# EAGLE schematic untitled (EAGLE 9.6.2)
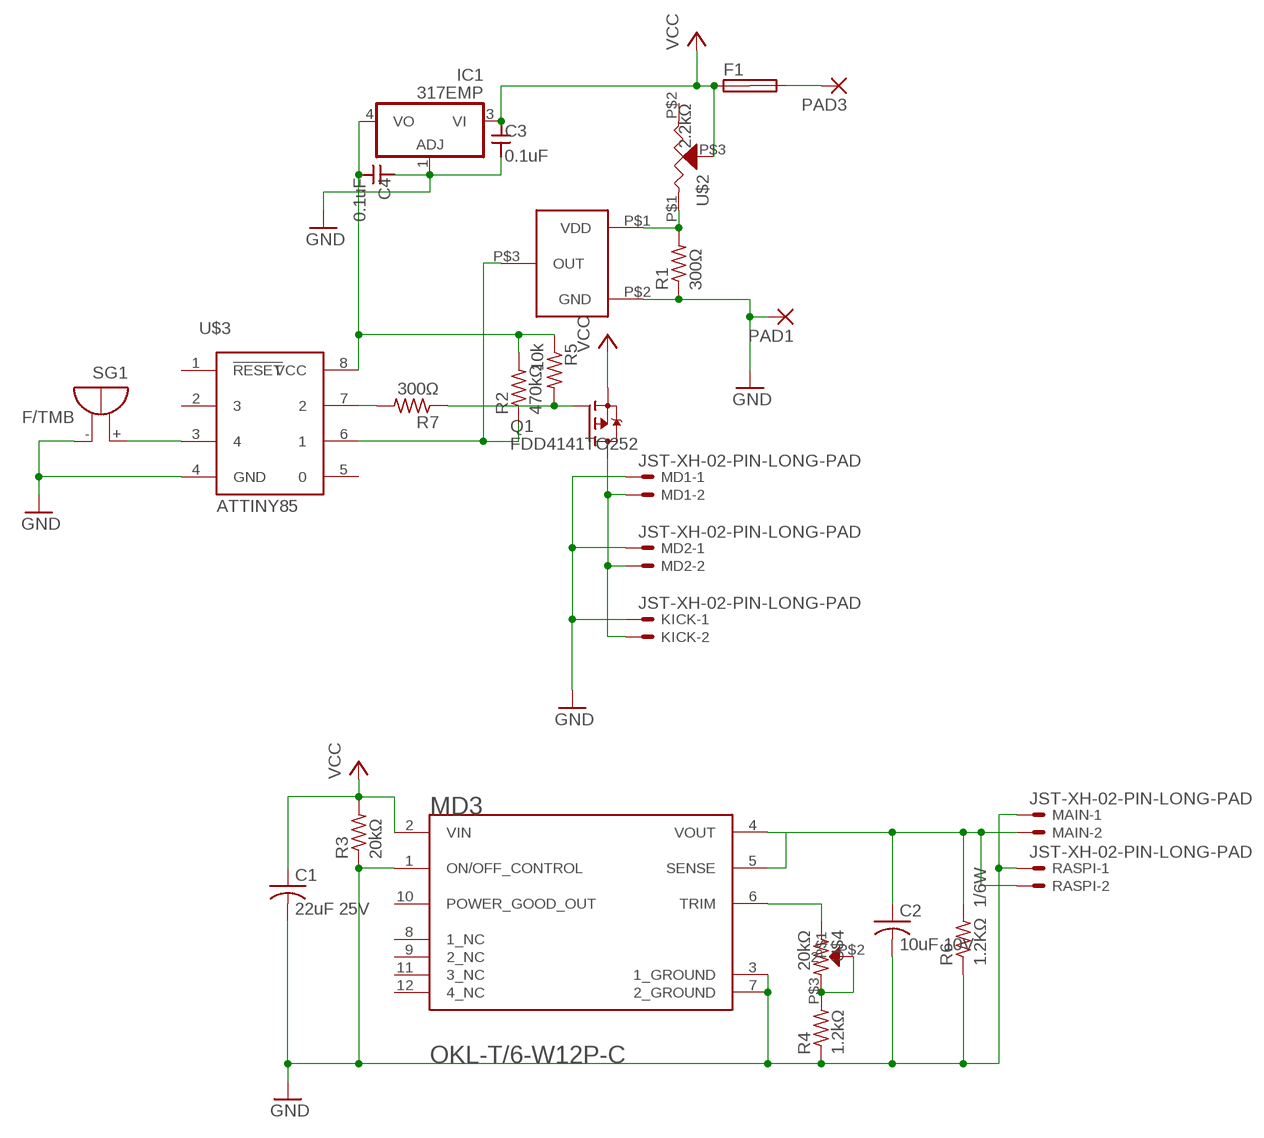
[diagram p0: schematic, sheet 1]

## Parts
C1  22uF 25V  C-USC2012  [C2012]
C2  10uF 10V  C-USC2012  [C2012]
C3  0.1uF  CAPACITOR1608  [SMD1608]
C4  0.1uF  CAPACITOR1608  [SMD1608]
F1  SHK20L  [SHK20L]
IC1  317EMP  [SOT223]
KICK  JST-XH-02-PIN-LONG-PAD  [JST-XH-02-PACKAGE-LONG-PAD]
MAIN  JST-XH-02-PIN-LONG-PAD  [JST-XH-02-PACKAGE-LONG-PAD]
MD1  JST-XH-02-PIN-LONG-PAD  [JST-XH-02-PACKAGE-LONG-PAD]
MD2  JST-XH-02-PIN-LONG-PAD  [JST-XH-02-PACKAGE-LONG-PAD]
MD3  OKL-T/6-W12P-CMURATA_OKL-T-6-W12P-C_0_0  [MURATA_OKL-T-6-W12P-C_0]
PAD1  3,81/1,4  [3,81/1,4]
PAD3  3,81/1,4  [3,81/1,4]
Q1  FDD4141TO252  [TO252]
R1  300Ω  R-US_M2012  [M2012]
R2  470kΩ  R-US_M2012  [M2012]
R3  20kΩ  R-US_M2012  [M2012]
R4  1.2kΩ  R-US_M2012  [M2012]
R5  10k  R-US_M2012  [M2012]
R6  1.2KΩ 1/6W  FLIPFLOP-RES  [0805-THM]
R7  300Ω  R-US_M2012  [M2012]
RASPI  JST-XH-02-PIN-LONG-PAD  [JST-XH-02-PACKAGE-LONG-PAD]
SG1  F/TMB  [F/TMB]
U$1  R3111N211A  [R3111N211A]
U$2  2.2kΩ  SMD-R-TRIM  [SMD-R-TRIM]
U$3  ATTINY85  [8P3]
U$4  20kΩ  R-TRIM  [R-TRIM]

## Nets
GND: C1.2 C2.2 C3.2 C4.1 IC1.1(ADJ) KICK.1 MAIN.1 MD1.1 MD2.1 MD3.1(ON/OFF_CONTROL) MD3.3(1_GROUND) MD3.7(2_GROUND) PAD1.1(P) R1.1 R3.1 R4.1 R6.1 RASPI.1 SG1.- U$1.P$2(GND) U$3.4(GND)
N$1: R1.2 U$1.P$1(VDD) U$2.P$1
N$2: Q1.1(G) R5.2 R7.1
N$3: F1.2A PAD3.1(P)
N$4: R2.1 U$1.P$3(OUT) U$3.6
N$5: KICK.2 MD1.2 MD2.2 Q1.3(D)
N$6: SG1.+ U$3.3
N$7: R4.2 U$4.P$2 U$4.P$3
N$8: C2.1 MAIN.2 MD3.4(VOUT) MD3.5(SENSE) R6.2 RASPI.2
N$9: MD3.6(TRIM) U$4.P$1
N$10: R7.2 U$3.7
N$11: C4.2 IC1.4(VO) R2.2 R5.1 U$3.8(VCC)
VCC: C1.1 C3.1 F1.1A IC1.3(VI) MD3.2(VIN) Q1.2(S) R3.2 U$2.P$3
Unconnected: F1.1B F1.2B MD3.8(1_NC) MD3.9(2_NC) MD3.10(POWER_GOOD_OUT) MD3.11(3_NC) MD3.12(4_NC) U$2.P$2 U$3.1(!RESET) U$3.2 U$3.5

## Library data of the parts
C1 C2 = adafruit:C-US: CAPACITOR, American symbol
C3 C4 = generic:CAPACITOR: Generic Capacitor
F1 = fuse:SHK20L: FUSE HOLDER 5 x 20 mm, SH contact, SHH1 Schukat, E1073 Buerklin; OC_FARNELL: unknown; OC_NEWARK: unknown
IC1 = linear:*317: Positive VOLTAGE REGULATOR
KICK MAIN MD1 MD2 RASPI = Rembrandt Electronics - JST XH Connectors v1-0:JST-XH-02-PIN: JST XH Connector 2 Pin Wire to board connector. Pitch: 2,54 mm, (0.100") Number of pins: 2 Created by Rembrandt Electronics www.rembrandtelectronics.com
MD3 = OKL-T_6-W12P-C:OKL-T/6-W12P-C: Non-Isolated PoL Module DC DC Converter 1 Output 0.591 ~ 5.5V - - 6A 4.5V - 14V Input Check availability <https://pricing.snapeda.com/parts/OKL-T/6-W12P-C/Murata%20Power%20Solutions%20Inc./view-part?ref=eda>; AVAILABILITY: In Stock; DESCRIPTION: Non-Isolated PoL Module DC DC Converter 1 Output 0.591 ~ 5.5V - - 6A 4.5V - 14V Input; MF: Murata Power Solutions Inc.; MP: OKL-T/6-W12P-C; PACKAGE: BLGA-12 Murata Power Solutions; PRICE: None; PURCHASE-URL: https://pricing.snapeda.com/search/part/OKL-T/6-W12P-C/?ref=eda
PAD1 PAD3 = wirepad:3,81/1,4: THROUGH-HOLE PAD
Q1 = transistor-fet:FDD4141: P-Channel PowerTrench® MOSFET Source: FDD4141.pdf
R1-R5 R7 = adafruit:R-US_: RESISTOR, American symbol
R6 = adafruit:FLIPFLOP-RES: Flip Flop resistor An 0805 resistor inside a standard 1/4W 5% resistor. Makes for easy mods
SG1 = buzzer:F/TMB: BUZZER Source: Buerklin; OC_FARNELL: unknown; OC_NEWARK: unknown
U$1 = R3111N211A:R3111N211A
U$2 = by_hirame:SMD-R-TRIM
U$3 = attiny85:ATTINY85
U$4 = by_hirame:R-TRIM